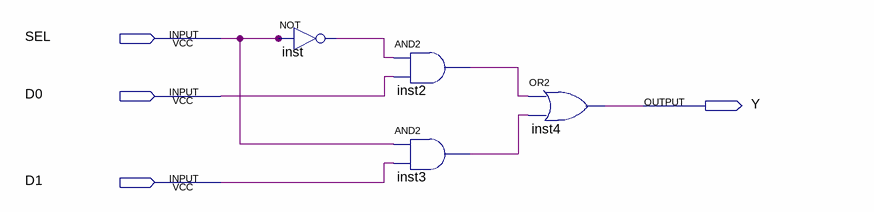
[diagram p0: schematic sheet]
// Quartus schematic data_sel2.bdf as structural Verilog: 4 symbols, 4 pins
module data_sel2 (
  input  SEL,
  input  D0,
  input  D1,
  output Y
);

  wire inst2_out, inst3_out, inst_out;

  not inst (inst_out, SEL);
  and inst2 (inst2_out, inst_out, D0);
  and inst3 (inst3_out, SEL, D1);
  or inst4 (Y, inst2_out, inst3_out);
endmodule
